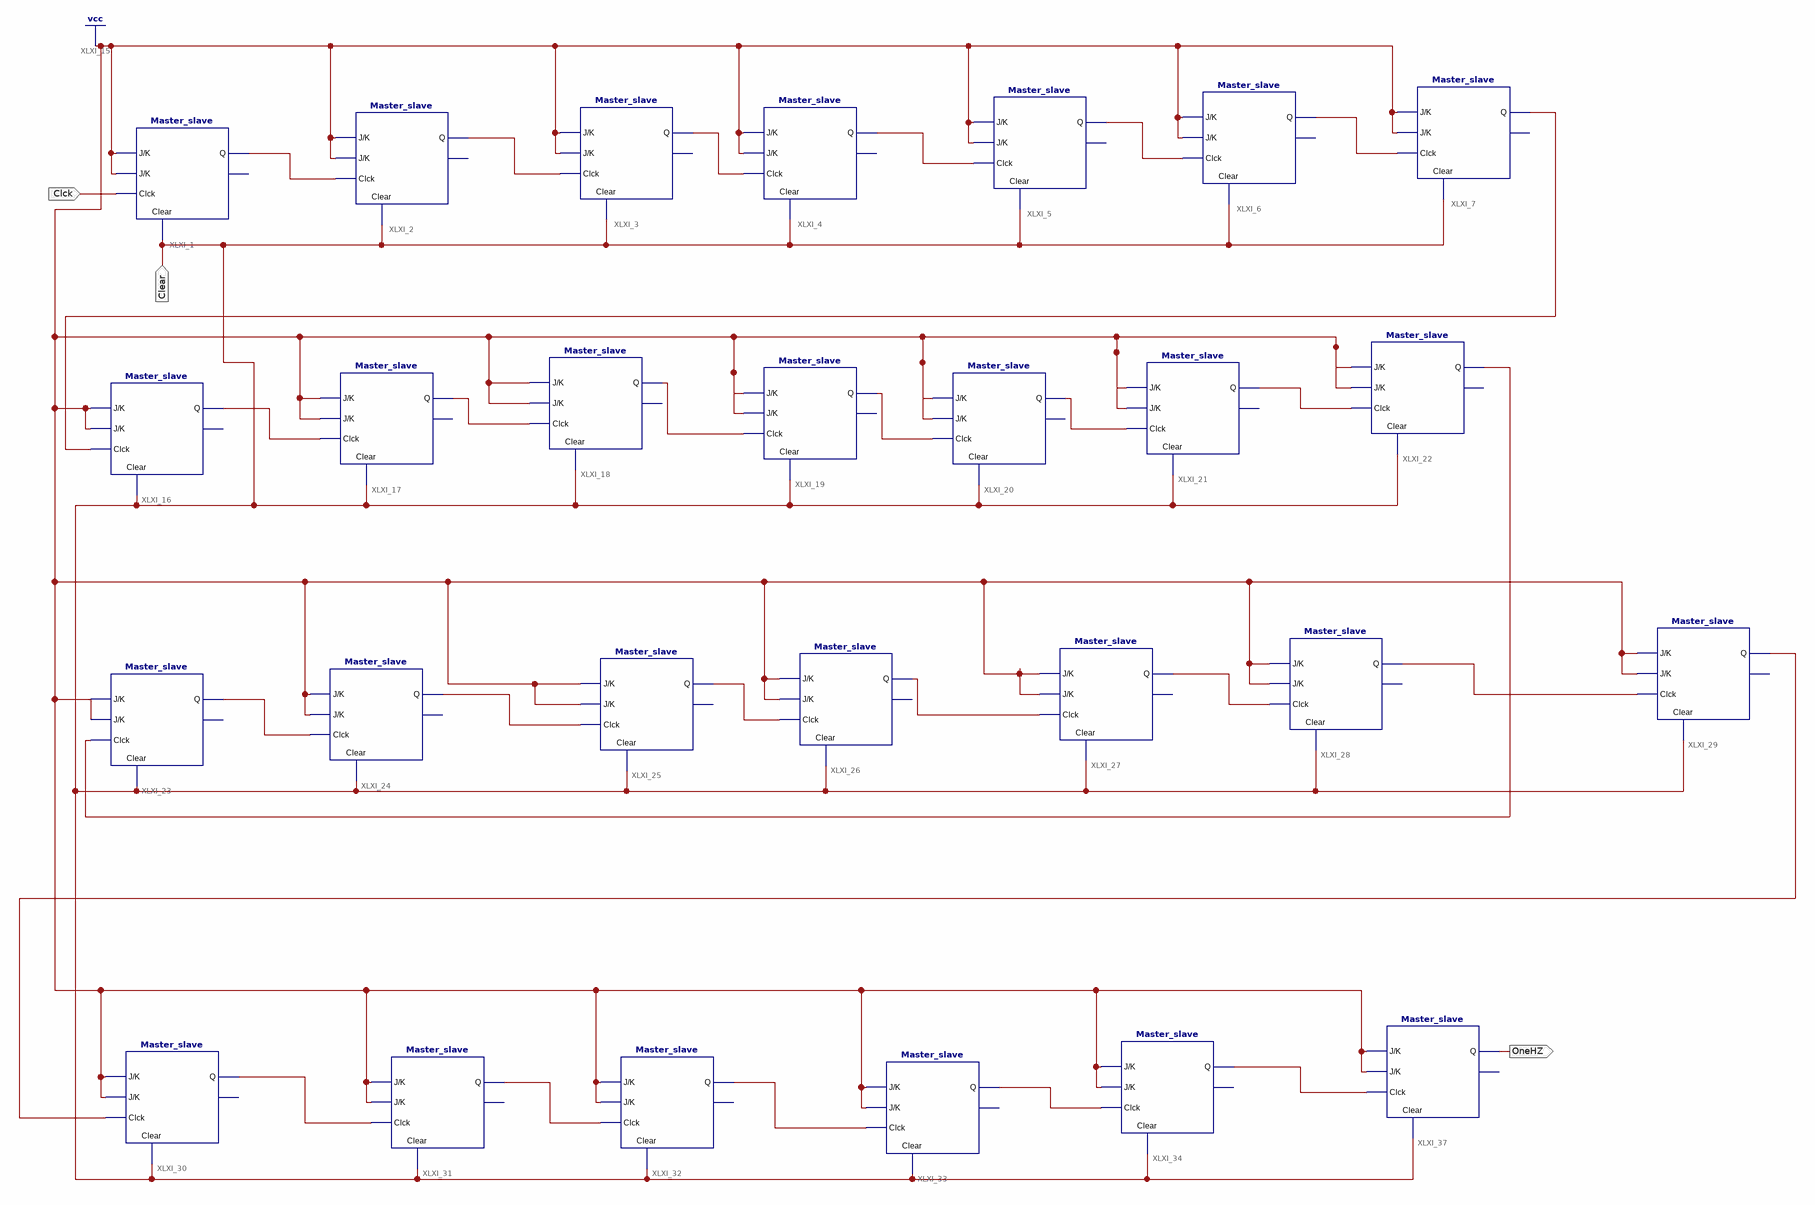
[diagram p0: schematic sheet 1]
// Xilinx ISE schematic Frequency_divider.sch (artix7) as structural Verilog: 27 symbols, 3 ports
module Frequency_divider (
  input  Clear,
  input  Clck,
  output OneHZ
);

  wire XLXN_1, XLXN_2, XLXN_3, XLXN_4, XLXN_5, XLXN_6, XLXN_41, XLXN_42, XLXN_43, XLXN_44, XLXN_45, XLXN_46,
       XLXN_48, XLXN_49, XLXN_50, XLXN_51, XLXN_52, XLXN_53, XLXN_95, XLXN_96, XLXN_100, XLXN_102, XLXN_103,
       XLXN_104, XLXN_107, XLXN_129;

  Master_slave XLXI_1 (.Clck(Clck), .Clear(Clear), .J(1'b1), .K(1'b1), .Q(XLXN_1));  // open: Q0
  Master_slave XLXI_2 (.Clck(XLXN_1), .Clear(Clear), .J(1'b1), .K(1'b1), .Q(XLXN_2));  // open: Q0
  Master_slave XLXI_3 (.Clck(XLXN_2), .Clear(Clear), .J(1'b1), .K(1'b1), .Q(XLXN_3));  // open: Q0
  Master_slave XLXI_4 (.Clck(XLXN_3), .Clear(Clear), .J(1'b1), .K(1'b1), .Q(XLXN_4));  // open: Q0
  Master_slave XLXI_5 (.Clck(XLXN_4), .Clear(Clear), .J(1'b1), .K(1'b1), .Q(XLXN_5));  // open: Q0
  Master_slave XLXI_6 (.Clck(XLXN_5), .Clear(Clear), .J(1'b1), .K(1'b1), .Q(XLXN_6));  // open: Q0
  Master_slave XLXI_7 (.Clck(XLXN_6), .Clear(Clear), .J(1'b1), .K(1'b1), .Q(XLXN_129));  // open: Q0
  Master_slave XLXI_16 (.Clck(XLXN_129), .Clear(Clear), .J(1'b1), .K(1'b1), .Q(XLXN_41));  // open: Q0
  Master_slave XLXI_17 (.Clck(XLXN_41), .Clear(Clear), .J(1'b1), .K(1'b1), .Q(XLXN_42));  // open: Q0
  Master_slave XLXI_18 (.Clck(XLXN_42), .Clear(Clear), .J(1'b1), .K(1'b1), .Q(XLXN_43));  // open: Q0
  Master_slave XLXI_19 (.Clck(XLXN_43), .Clear(Clear), .J(1'b1), .K(1'b1), .Q(XLXN_44));  // open: Q0
  Master_slave XLXI_20 (.Clck(XLXN_44), .Clear(Clear), .J(1'b1), .K(1'b1), .Q(XLXN_45));  // open: Q0
  Master_slave XLXI_21 (.Clck(XLXN_45), .Clear(Clear), .J(1'b1), .K(1'b1), .Q(XLXN_46));  // open: Q0
  Master_slave XLXI_22 (.Clck(XLXN_46), .Clear(Clear), .J(1'b1), .K(1'b1), .Q(XLXN_95));  // open: Q0
  Master_slave XLXI_23 (.Clck(XLXN_95), .Clear(Clear), .J(1'b1), .K(1'b1), .Q(XLXN_48));  // open: Q0
  Master_slave XLXI_24 (.Clck(XLXN_48), .Clear(Clear), .J(1'b1), .K(1'b1), .Q(XLXN_49));  // open: Q0
  Master_slave XLXI_25 (.Clck(XLXN_49), .Clear(Clear), .J(1'b1), .K(1'b1), .Q(XLXN_50));  // open: Q0
  Master_slave XLXI_26 (.Clck(XLXN_50), .Clear(Clear), .J(1'b1), .K(1'b1), .Q(XLXN_51));  // open: Q0
  Master_slave XLXI_27 (.Clck(XLXN_51), .Clear(Clear), .J(1'b1), .K(1'b1), .Q(XLXN_52));  // open: Q0
  Master_slave XLXI_28 (.Clck(XLXN_52), .Clear(Clear), .J(1'b1), .K(1'b1), .Q(XLXN_53));  // open: Q0
  Master_slave XLXI_29 (.Clck(XLXN_53), .Clear(Clear), .J(1'b1), .K(1'b1), .Q(XLXN_96));  // open: Q0
  Master_slave XLXI_30 (.Clck(XLXN_96), .Clear(Clear), .J(1'b1), .K(1'b1), .Q(XLXN_100));  // open: Q0
  Master_slave XLXI_31 (.Clck(XLXN_100), .Clear(Clear), .J(1'b1), .K(1'b1), .Q(XLXN_102));  // open: Q0
  Master_slave XLXI_32 (.Clck(XLXN_102), .Clear(Clear), .J(1'b1), .K(1'b1), .Q(XLXN_103));  // open: Q0
  Master_slave XLXI_33 (.Clck(XLXN_103), .Clear(Clear), .J(1'b1), .K(1'b1), .Q(XLXN_104));  // open: Q0
  Master_slave XLXI_34 (.Clck(XLXN_104), .Clear(Clear), .J(1'b1), .K(1'b1), .Q(XLXN_107));  // open: Q0
  Master_slave XLXI_37 (.Clck(XLXN_107), .Clear(Clear), .J(1'b1), .K(1'b1), .Q(OneHZ));  // open: Q0
endmodule
